# EasyEDA schematic schematic.json
TITLE: Sheet_1; REV: 1.0; Date: 2025-01-20; Sheet: 1/1; Drawn By: voidsshadows1; Company: Your Company
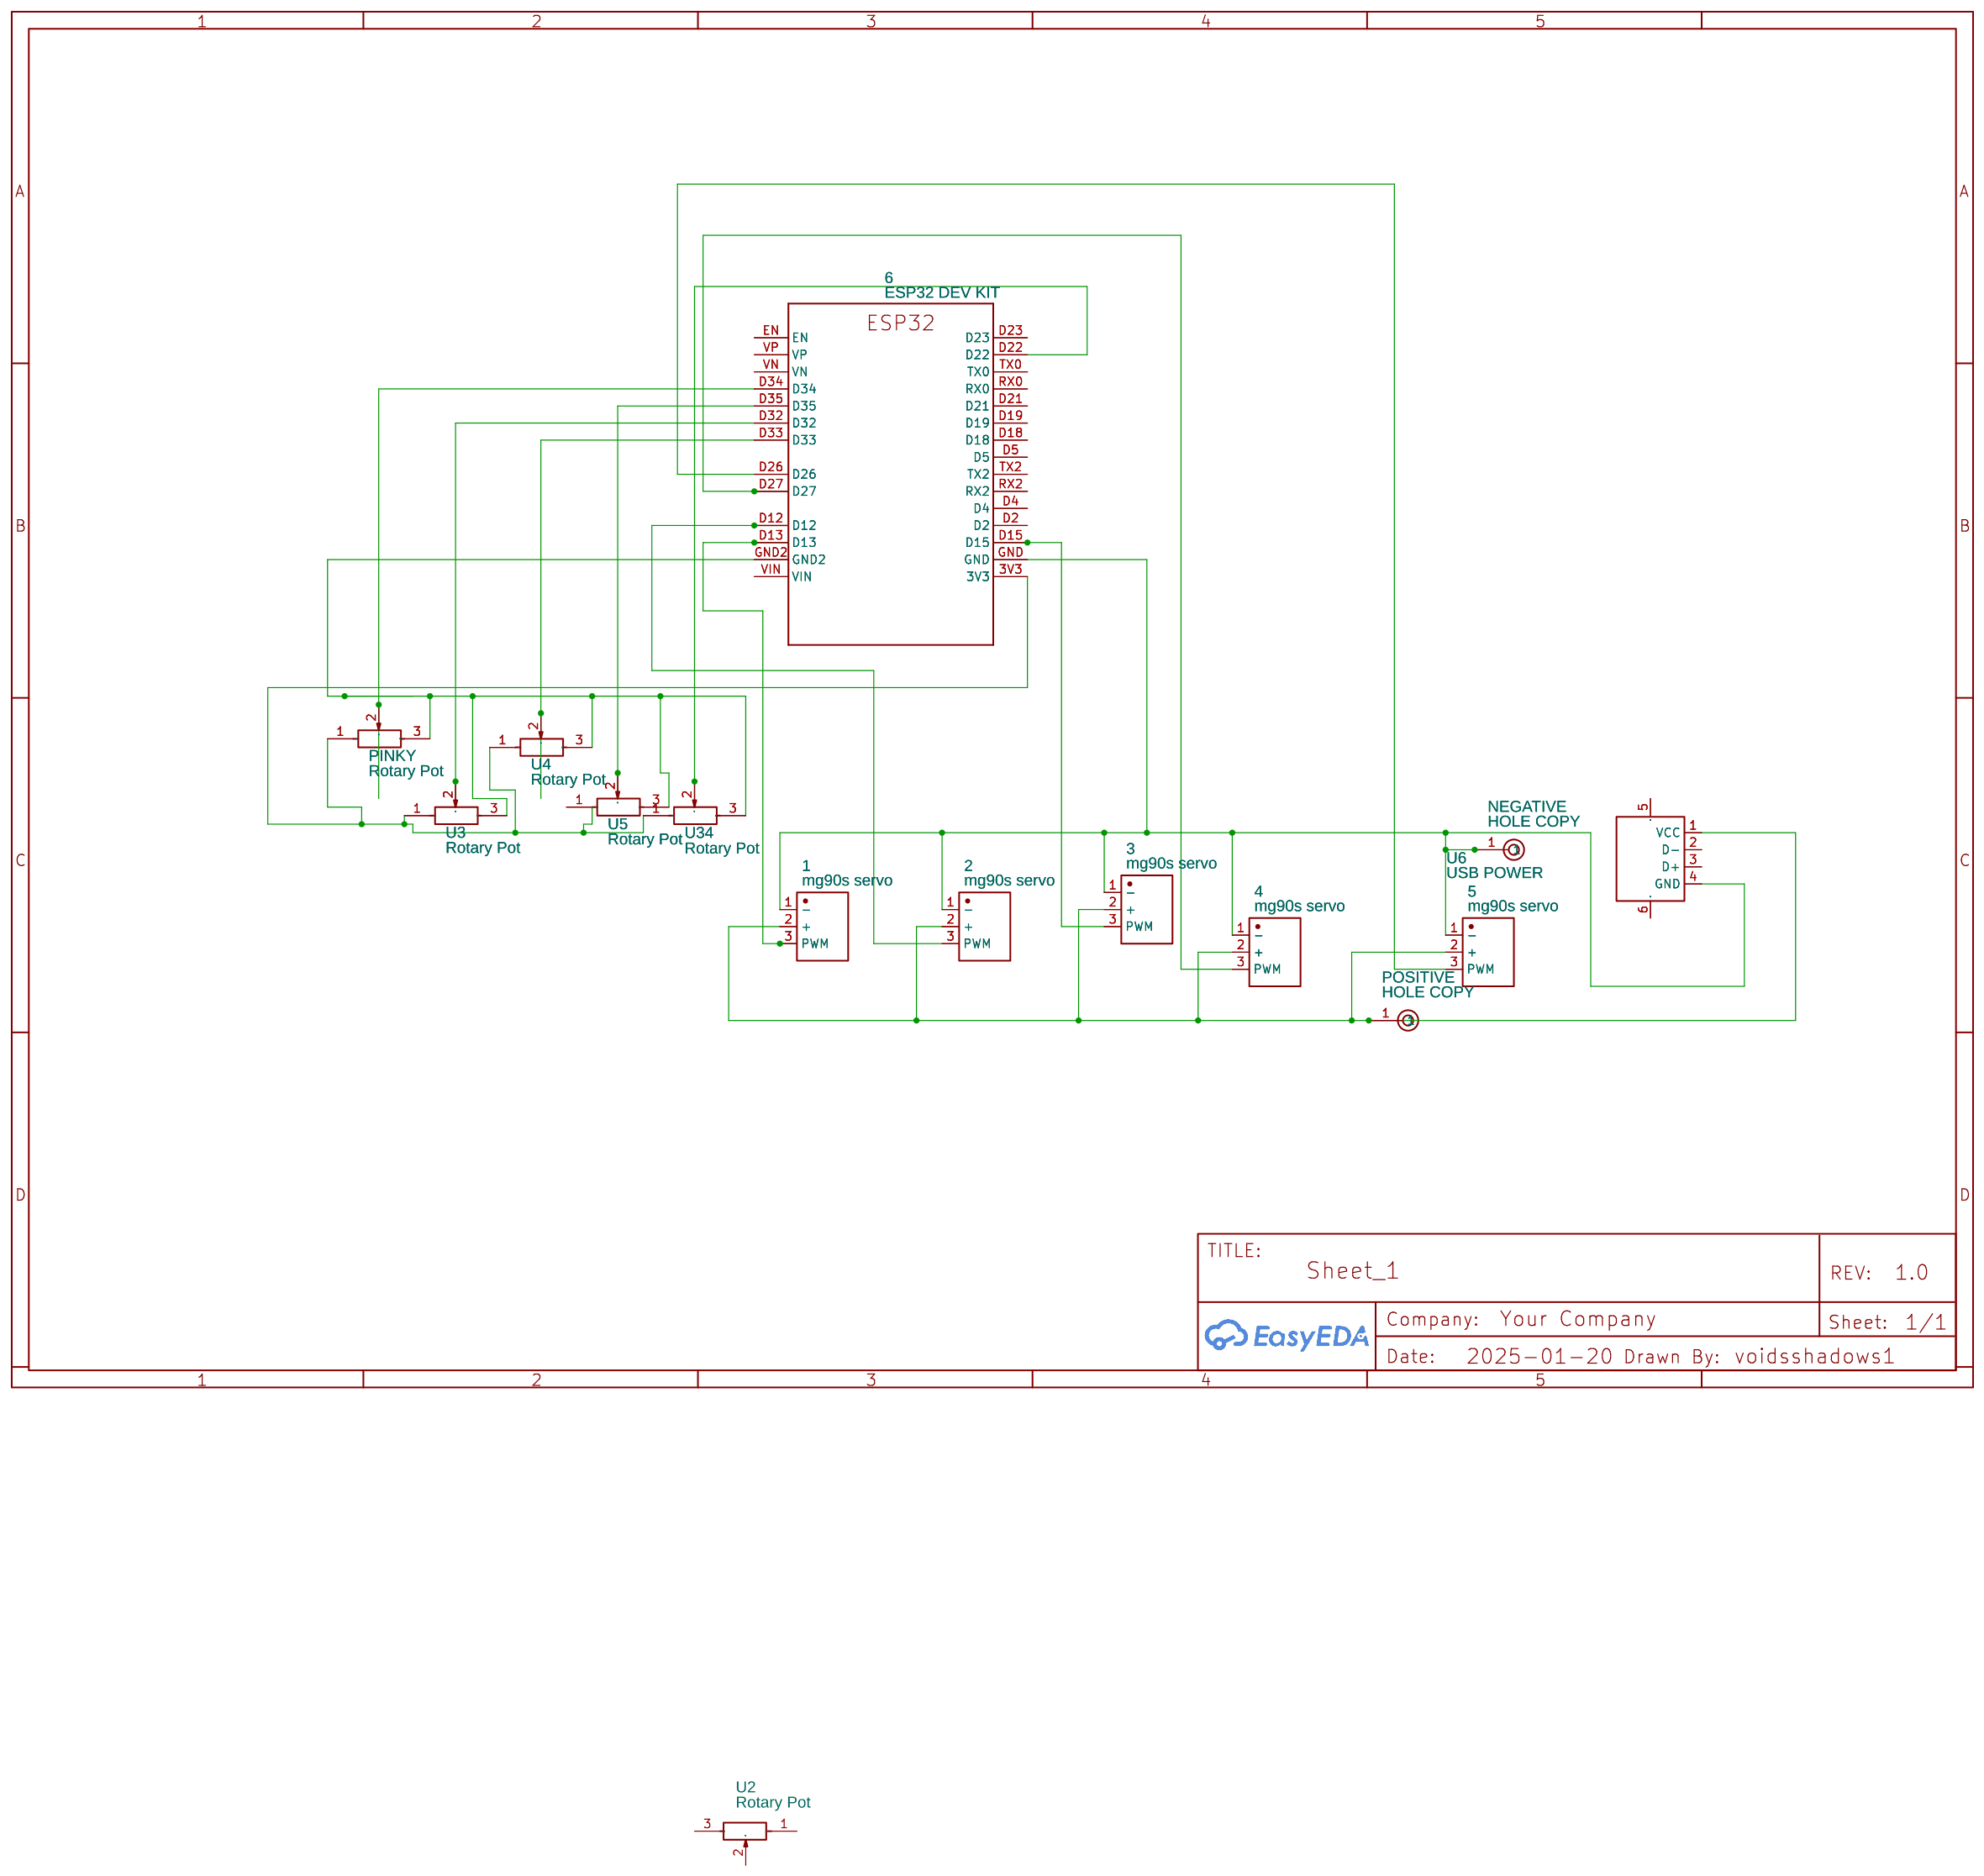
[diagram p0: schematic sheet]

## Parts
1  mg90s servo  [MG90S SERVO]
2  mg90s servo  [MG90S SERVO]
3  mg90s servo  [MG90S SERVO]
4  mg90s servo  [MG90S SERVO]
5  mg90s servo  [MG90S SERVO]
6  ESP32 DEV KIT  [ESP32-DEVKITV1_ESP32-DEVKITV1]
NEGATIVE  HOLE COPY  [HOLEHOLE]
PINKY  Rotary Pot  [ROTARY POT]
POSITIVE  HOLE COPY  [HOLEHOLE]
U2  Rotary Pot  [ROTARY POT]
U3  Rotary Pot  [ROTARY POT]
U4  Rotary Pot  [ROTARY POT]
U5  Rotary Pot  [ROTARY POT]
U6  USB POWER  [USB-A-TH_USB-AF-DIP-546-HW-B]
U34  Rotary Pot  [ROTARY POT]

## Library data of the parts
1-5 = mg90s servo: Contributor: ailingcord2006
6 = ESP32-DEVKIT-V1-30PIN: Contributor: u18040382
NEGATIVE POSITIVE = HOLE COPY: Contributor: Fishy
PINKY U2-U5 U34 = Rotary Pot: Contributor: crishcreative
U6 = USB-AF-DIP-546-HW-B: Supplier: LCSC; Supplier Part: C2904901; Manufacturer: 皇捷; JLCPCB Part Class: Extended Part; Contributor: lcsc

## Nets
Net-(1-1): 1.1(-) 2.1(-) 3.1(-) 4.1(-) 5.1(-) 6.GND NEGATIVE.1 U6.4(GND)
Net-(1-2): 1.2(+) 2.2(+) 3.2(+) 4.2(+) 5.2(+) POSITIVE.1 U6.1(VCC)
Net-(1-3): 1.3(PWM) 6.D13
Net-(2-3): 2.3(PWM) 6.D12
Net-(3-3): 3.3(PWM) 6.D15
Net-(4-3): 4.3(PWM) 6.D27
Net-(5-3): 5.3(PWM) 6.D26
Net-(6-3V3): 6.3V3 PINKY.1 U3.1 U4.1 U34.1
Net-(6-D22): 6.D22 U34.2
Net-(6-D32): 6.D32 U3.2
Net-(6-D33): 6.D33 U4.2
Net-(6-D34): 6.D34 PINKY.2
Net-(6-D35): 6.D35 U5.2
Net-(6-GND2): 6.GND2 PINKY.3 U3.3 U4.3 U5.3 U34.3

Not connected (* = marked no-connect by the designer): 6 D2 D4 D5 D18 D19 D21 D23 EN RX0 RX2 TX0 TX2 VIN VN VP; U2 1 2 3; U5 1; U6 2(D-) 3(D+) 5(EH) 6(EH)
